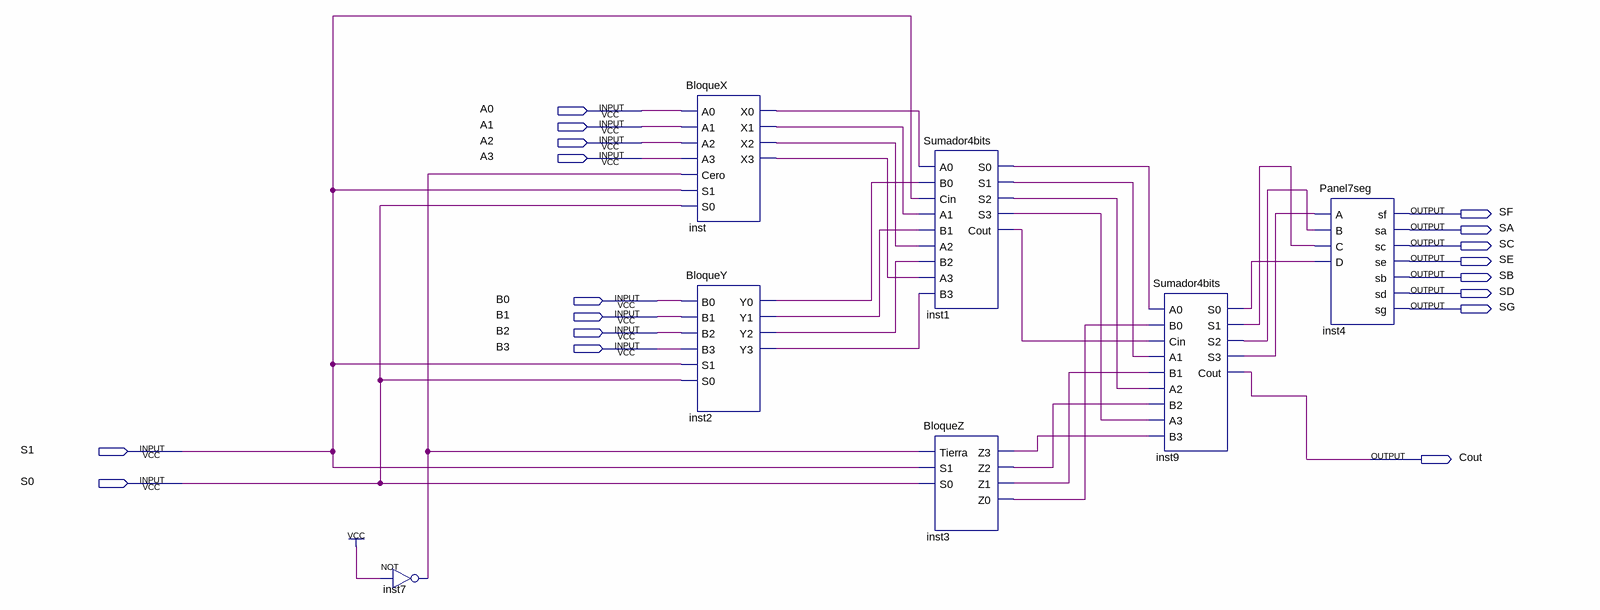
[diagram p0: schematic sheet]
// Quartus schematic BloqueAritmetico.bdf as structural Verilog: 7 symbols, 18 pins
module BloqueAritmetico (
  input  A0,
  input  A1,
  input  A2,
  input  A3,
  input  B0,
  input  B1,
  input  B2,
  input  B3,
  input  S1,
  input  S0,
  output SF,
  output SA,
  output SC,
  output SE,
  output SB,
  output SD,
  output SG,
  output Cout
);

  wire inst1_cout, inst1_s0, inst1_s1, inst1_s2, inst1_s3, inst2_y0, inst2_y1, inst2_y2, inst2_y3, inst3_z0,
       inst3_z1, inst3_z2, inst3_z3, inst7_out, inst9_s0, inst9_s1, inst9_s2, inst9_s3, inst_x0, inst_x1,
       inst_x2, inst_x3;

  not inst7 (inst7_out, 1'b1);
  BloqueX inst (
    .A0(A0), .A1(A1), .A2(A2), .A3(A3), .Cero(inst7_out), .S1(S1), .S0(S0), .X0(inst_x0), .X1(inst_x1),
    .X2(inst_x2), .X3(inst_x3));
  BloqueY inst2 (
    .B0(B0), .B1(B1), .B2(B2), .B3(B3), .S1(S1), .S0(S0), .Y0(inst2_y0), .Y1(inst2_y1), .Y2(inst2_y2),
    .Y3(inst2_y3));
  Sumador4bits inst1 (
    .A0(inst_x0), .B0(inst2_y0), .Cin(S1), .A1(inst_x1), .B1(inst2_y1), .A2(inst_x2), .B2(inst2_y2),
    .A3(inst_x3), .B3(inst2_y3), .S0(inst1_s0), .S1(inst1_s1), .S2(inst1_s2), .S3(inst1_s3), .Cout(inst1_cout));
  BloqueZ inst3 (.Tierra(inst7_out), .S1(S1), .S0(S0), .Z3(inst3_z3), .Z2(inst3_z2), .Z1(inst3_z1), .Z0(inst3_z0));
  Sumador4bits inst9 (
    .A0(inst1_s0), .B0(inst3_z0), .Cin(inst1_cout), .A1(inst1_s1), .B1(inst3_z1), .A2(inst1_s2),
    .B2(inst3_z2), .A3(inst1_s3), .B3(inst3_z3), .S0(inst9_s0), .S1(inst9_s1), .S2(inst9_s2), .S3(inst9_s3),
    .Cout(Cout));
  Panel7seg inst4 (
    .A(inst9_s3), .B(inst9_s2), .C(inst9_s1), .D(inst9_s0), .sf(SF), .sa(SA), .sc(SC), .se(SE), .sb(SB),
    .sd(SD), .sg(SG));
endmodule
